# EAGLE design eurorack-passive-vca (EAGLE 9.6.2)
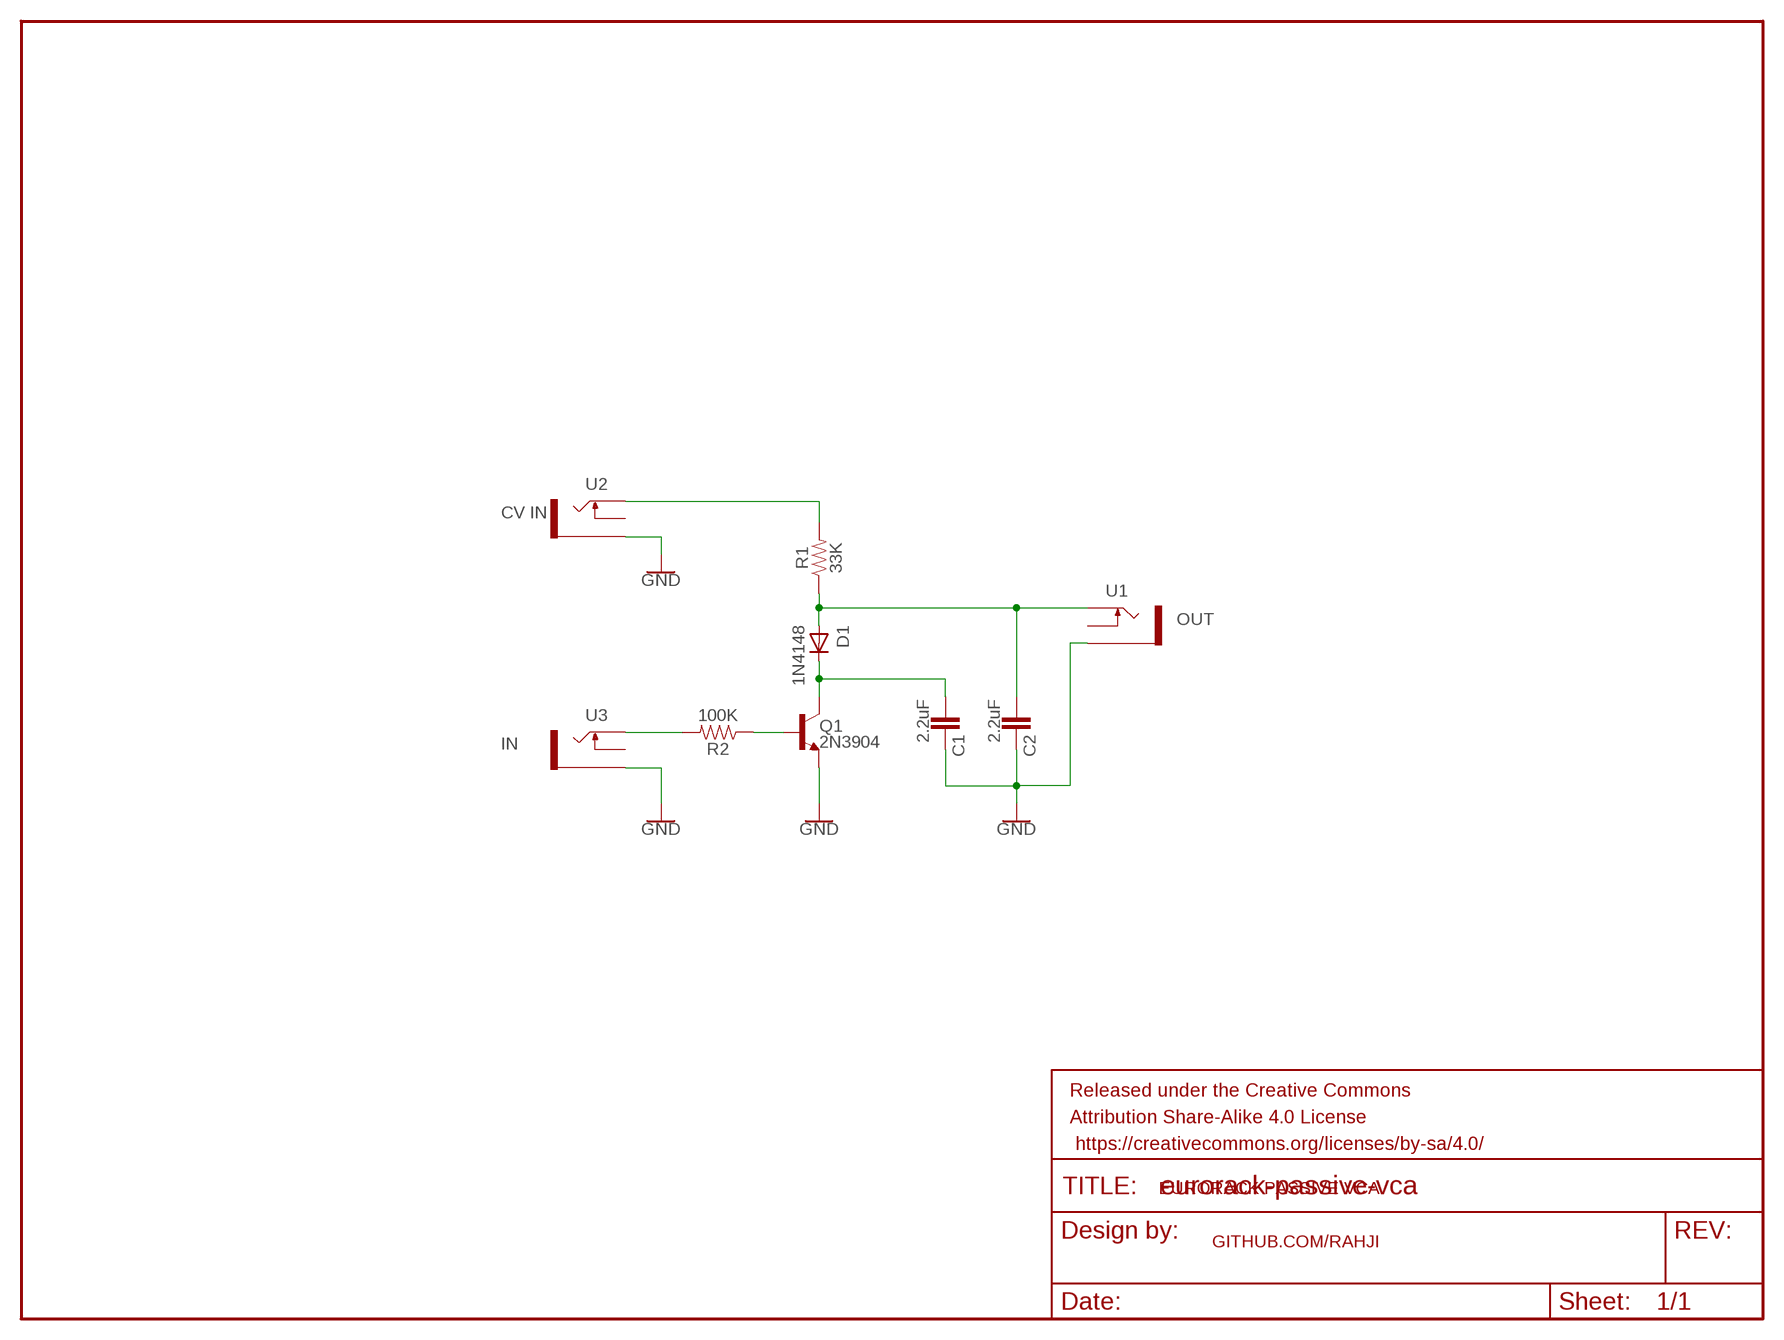
[diagram p0: schematic, sheet 1]

## Parts
C1  2.2uF  22PF-PTH-2.54MM-200V-5%  [CAP-PTH-2.54]
C2  2.2uF  22PF-PTH-2.54MM-200V-5%  [CAP-PTH-2.54]
D1  1N4148  DIODEDO-1N4148  [DO-1N4148]
FRAME1  FRAME-LETTERNO_PACKAGE  [DUMMY]
Q1  2N3904  TRANS_NPN-2N3904  [TO-92]
R1  33K  100OHM-HORIZ-1/4W-1%  [AXIAL-0.3]
R2  100K  100OHM-HORIZ-1/4W-1%  [AXIAL-0.3]
U1  OUT  THONKICONNNEW  [WQP-PJ301M-12_JACK]
U2  CV IN  THONKICONNNEW  [WQP-PJ301M-12_JACK]
U3  IN  THONKICONNNEW  [WQP-PJ301M-12_JACK]

## Nets
GND: C1.1 C2.1 Q1.1(E) U1.P$3_SLEEVE(SLEEVE) U2.P$3_SLEEVE(SLEEVE) U3.P$3_SLEEVE(SLEEVE)
N$1: R1.P$2 U2.P$1_TIP(TIP)
N$2: C2.2 D1.A R1.P$1 U1.P$1_TIP(TIP)
N$4: R2.P$2 U3.P$1_TIP(TIP)
N$5: Q1.2(B) R2.P$1
N$6: C1.2 D1.C Q1.3(C)
Unconnected: U1.P$2_SWITCH(SWITCH) U2.P$2_SWITCH(SWITCH) U3.P$2_SWITCH(SWITCH)

## Notes on the sheet
- CV IN
- OUT
- IN
- EURORACK PASSIVE VCA
- GITHUB.COM/RAHJI

## Library data of the parts
C1 C2 = SparkFun-Capacitors:22PF: 22pF ceramic capacitors A capacitor is a passive two-terminal electrical component used to store electrical energy temporarily in an electric field.; PROD_ID: CAP-09128; VALUE: 22pF
D1 = adafruit:DIODE: Diode SMADIODE - SMA Surface Mount Package 20V 1A Schottky Diode Digikey: 641-1014-6-ND DO-1N4148 - Through Hole Small Current Diode SOD-123 20V 1 A (.5mV Vf) Schottky Diode - Digikey: MBRX120TPMSCT-ND SOD-323 10V 570mA (.38mV Vf, 3ns) Schottky Diode - Digikey: ZLLS410CT-ND SOD-523 30V 30mA Schottky Diode (RB751S-40TE61) - Digikey: RB751S-40TE61CT-ND SOT23-R/W - SOT23 Package (R = Solder Paste/Reflow Ovens, W = Hand-Soldering) BAT54Film 40V 300mA - Digikey: 497-7162-1-ND
FRAME1 = SparkFun-Aesthetics:FRAME-LETTER: Schematic Frame - Letter Standard 8.5x11 US Letter frame; DESIGNER: Nobody; VERSION: v01
Q1 = SparkFun-DiscreteSemi:TRANS_NPN: NPN transistor Current controlled devices typically used to amplify current or used as a switch. BC547 - COM-08928 <http://www.sparkfun.com/products/8928> (TO-92 45V 100mA) (1.Collector 2.Base 3.Emitter) 2N3904 - COM-00521 <http://www.sparkfun.com/products/521> (TO-92 40V 200mA) (1.Emitter 2.Base 3.Collector) P2N2222A - COM-12852 <http://www.sparkfun.com/products/12852> (TO-92 40V 600mA) (1.Collector 2.Base 3.Emitter); PROD_ID: TRANS-08447; VALUE: 200mA/40V
R1 R2 = SparkFun-Resistors:100OHM: 100Ω resistor A resistor is a passive two-terminal electrical component that implements electrical resistance as a circuit element. Resistors act to reduce current flow, and, at the same time, act to lower voltage levels within circuits. - Wikipedia; PROD_ID: RES-12181; VALUE: 100
U1-U3 = MusicThingModular:THONKICONN: 3.5mm socket for Eurorack modular synths

## Board
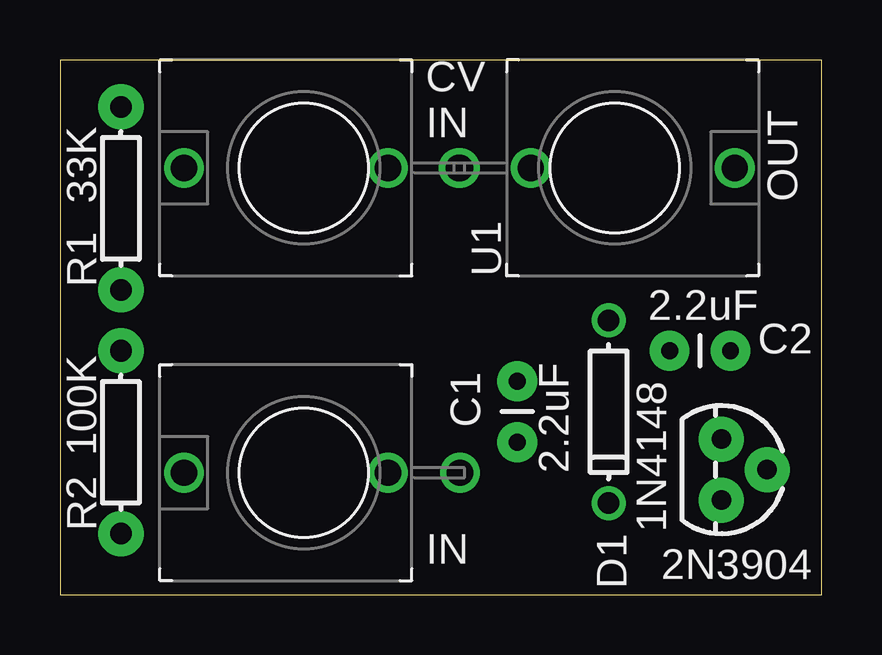
[diagram p1: board, top side]
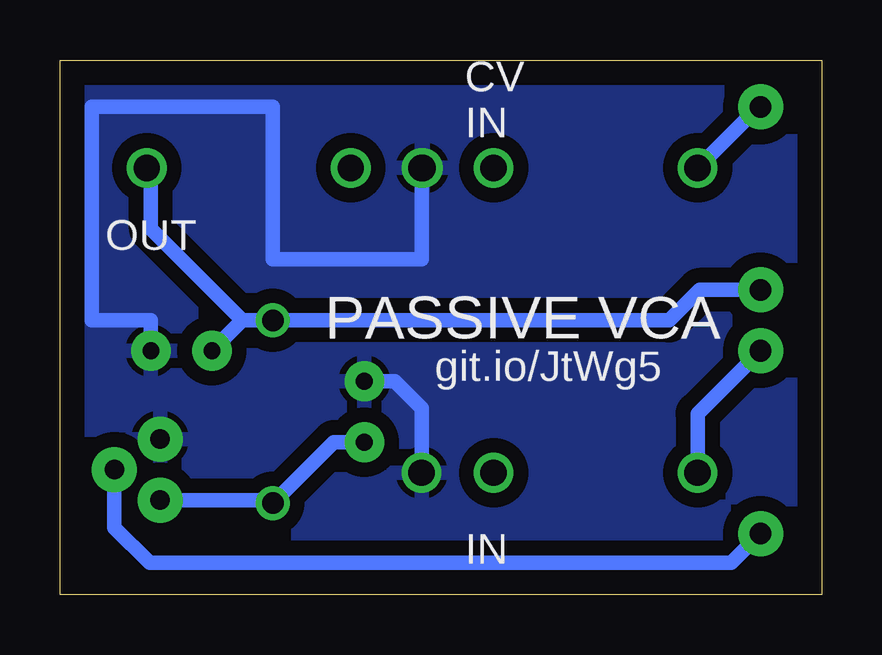
[diagram p2: board, bottom side, seen from below]

Size 31.73 x 22.28 mm. Coordinates in mm from the lower left corner, seen from the top.
Outline: 0,0 31.73,0 31.73,22.28 0,22.28 0,0
Copper layers (1*16): Top 0.035mm / dielectric 0.15mm / Bottom 0.035mm
Design rules "default": minimum track width 6mil, minimum drill 0.35mm, track to track 6mil, track to pad 6mil, pad to pad 6mil, via to via 6mil, smd to smd 6mil, copper to edge 40mil, drill to drill 6mil, minimum pad ring 10mil, minimum via ring 8mil, stop-mask expansion 4mil, vias tented up to drill 0mil, thermal gap 10mil

### Footprints (pad centres in the part's own frame; a part is rotated, then mirrored left to right if it is on the bottom)
CAP-PTH-2.54 = drill 0.7 pad 1.651: 1 -1.27,0; 2 1.27,0
DO-1N4148 = drill 0.9: A -3.81,0; C 3.81,0
TO-92 = drill 0.813 pad 1.88: 1 -1.27,0; 2 0,1.905; 3 1.27,0
AXIAL-0.3 = drill 0.9 pad 1.88: P$1 -3.81,0; P$2 3.81,0
WQP-PJ301M-12_JACK = drill 1.1: P$1_TIP 0,5; P$2_SWITCH 0,-3.5; P$3_SLEEVE 0,-6.5

### Placement (x,y rotation side)
C1  19.05,7.62 270 top
C2  26.67,10.16 180 top
D1  22.86,7.62 270 top
FRAME1  -1.27,-2.54 0 top
Q1  27.56,5.21 270 top
R1  2.54,16.51 90 top
R2  2.54,6.35 90 top
U1  23.11,17.78 270 top
U2  10.16,17.78 90 top
U3  10.16,5.08 90 top

### Tracks (layer width: path | path; a pad name or v marks a point on that pad's centre or on a via)
GND
  Bottom 0.61: U3.P$3_SLEEVE 16.66,7.77 17.78,8.89 C1.1 | U2.P$3_SLEEVE 16.66,13.97 22.86,13.97 22.86,20.32 30.41,20.32 30.41,11.43 27.94,11.43 C2.1
  pour Bottom (isolate 0.61): -1.27,24.13 33.02,24.13 33.02,-1.27 -1.27,-1.27
N$1
  Bottom 0.61: R1.P$2 2.62,20.32 U2.P$1_TIP
N$2
  Bottom 0.61: U1.P$1_TIP 27.94,17.61 27.94,15.24 24.13,11.43 | R1.P$1 5.08,12.7 6.35,11.43 D1.A 24.13,11.43 | 24.13,11.43 C2.2
N$4
  Bottom 0.61: R2.P$2 5.16,7.54 U3.P$1_TIP
N$5
  Bottom 0.61: R2.P$1 3.76,1.32 27.99,1.32 29.46,2.79 Q1.2
N$6
  Bottom 0.61: C1.2 20.32,6.35 D1.C 22.99,3.94 Q1.3

### Text on the board
tNames: CV / IN | OUT | IN
bNames: CV / IN | OUT | PASSIVE VCA | git.io/JtWg5 | IN